# Altium schematic sheet helloworld.SchDoc
size A4; SheetNumber: 1; SheetTotal: 1; SPICEModelCacheSOFVHQAA: <root> / <DocumentId>SOFVHQAA</DocumentId> / </root>
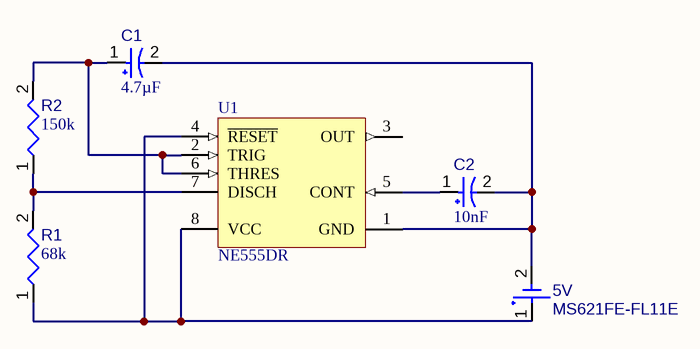
[diagram p0: helloworld.SchDoc]

## Parts
5V  MS621FE-FL11E  [SEIK-MS621FE-FL11E-2_V]
C1  value 4.7µF  [CAPPR55-200-1100X500X1200]  (hidden comment: ECA-1HHG010)
C2  value 10nF  [CAPPR55-200-1100X500X1200]  (hidden comment: ECA-1HHG010)
R1  value 68k  [RESA86-1060X240]  (hidden comment: 12FR050E)
R2  value 150k  [RESA86-1060X240]  (hidden comment: 12FR050E)
U1  NE555DR  [D0008A_N]

## Nets
Net5V_1: 5V.1(+) R1.1 U1.4(~{RESET}) U1.8(VCC)
Net5V_2: 5V.2(-) C1.2 C2.2 U1.1(GND)
NetC1_1: C1.1 R2.2 U1.2(TRIG) U1.6(THRES)
NetC2_1: C2.1 U1.5(CONT)
NetR1_2: R1.2 R2.1 U1.7(DISCH)

Not connected (* = marked no-connect by the designer): U1 3(OUT)

## Library data of the parts
5V = CMP-00029-00000-1: MS Lihium Rechargeable Battery, 3 V, -20 to 60 degC, Tray; RoHS Compliant: NotApplicable; Mounting Technology: WithLeads; Pins: 2
C1 C2 = CMP-001-00024-7: Aluminum Electrolytic Capacitor, 1 uF, +/- 20%, 50 V, -55 to 105 degC, 2-Pin THD, RoHS, Bulk; Manufacturer: Panasonic; Voltage Rating: 50V; Ripple Current: 10mA; Packaging: Bulk; Package Quantity: 200; Tolerance: 20%; Min Operating Temperature: -55°C; Diameter: 5mm; Capacitor Type: Electrolytic; Datasheet Version: Mar-05; Ripple Current (AC): 10mA; Manufacturer URL: http://www.panasonic.com/; Case/Package: Radial; Mounting Technology: TH; Pins: 2; Package Reference: CAPPR55-200-1100X500X1200; Package Description: 2-Pin Radial Lead, Dia 5 mm, Height 12 mm; RoHS Compliant: True; Max Operating Temperature: 105°C; Lead Pitch: 2mm; Datasheet URL: https://datasheet.ciiva.com/7275/94060-7275472.pdf
R1 R2 = CMP-009-00035-4: Axial Resistor, 50 mOhm, +/- 1%, 2 W, -55 to 275 degC, 2-Pin THD, RoHS, Bulk; Manufacturer: Ohmite; Voltage Rating: 100mV; Power: 2W; Manufacturer URL: http://www.ohmite.com/; Composition: Wirewound; Datasheet URL: http://www.ohmite.com/cat/res_10.pdf; Mounting Technology: TH; Tolerance: 1%; Diameter: 2.4mm; Package Description: 2-Pin Axial Lead, Dia 2.4 mm, Body Length 10.6 mm; Datasheet Version: Jun-15; Packaging: Bulk; Max Operating Temperature: 275°C; RoHS Compliant: True; Package Quantity: 10; Case/Package: Axial; Pins: 2; Package Reference: 12FR050E; Min Operating Temperature: -55°C
U1 = CMP-016-00007-3: Precision Timer, 4.5 to 16 V, 0 to 70 degC, 8-Pin SOIC (D), Green (RoHS & no Sb/Br), Tape and Reel; Manufacturer: Texas Instruments; Max Ouput Current: -200mA; Frequency: 100kHz; Max Supply Voltage: 16V; Min Supply Voltage: 4.5V; Package Version: 4040047-3/M, 06/2011; Datasheet Version: SLFS022I, 09/2014; Datasheet URL: http://www.ti.com/general/docs/lit/getliterature.tsp?genericPartNumber=NE555&fileType=pdf; Package Reference: D0008A; Min Operating Temperature: 0°C; Case/Package: SOIC; Pins: 8; RoHS Compliant: True; Packaging: TapeandReel; Package Quantity: 2500; Package URL: http://www.ti.com/lit/ml/msoi002j/msoi002j.pdf; Package Description: 8-Pin Small Outline Integrated Circuit, Body 4.9 x 3.9 mm, Pitch 1.27 mm; Mounting Technology: SM; Max Operating Temperature: 70°C; Manufacturer URL: http://www.ti.com/